# Altium schematic sheet MX8M-Nano-Misc.SchDoc
size B; SheetNumber: 4; SheetTotal: 15
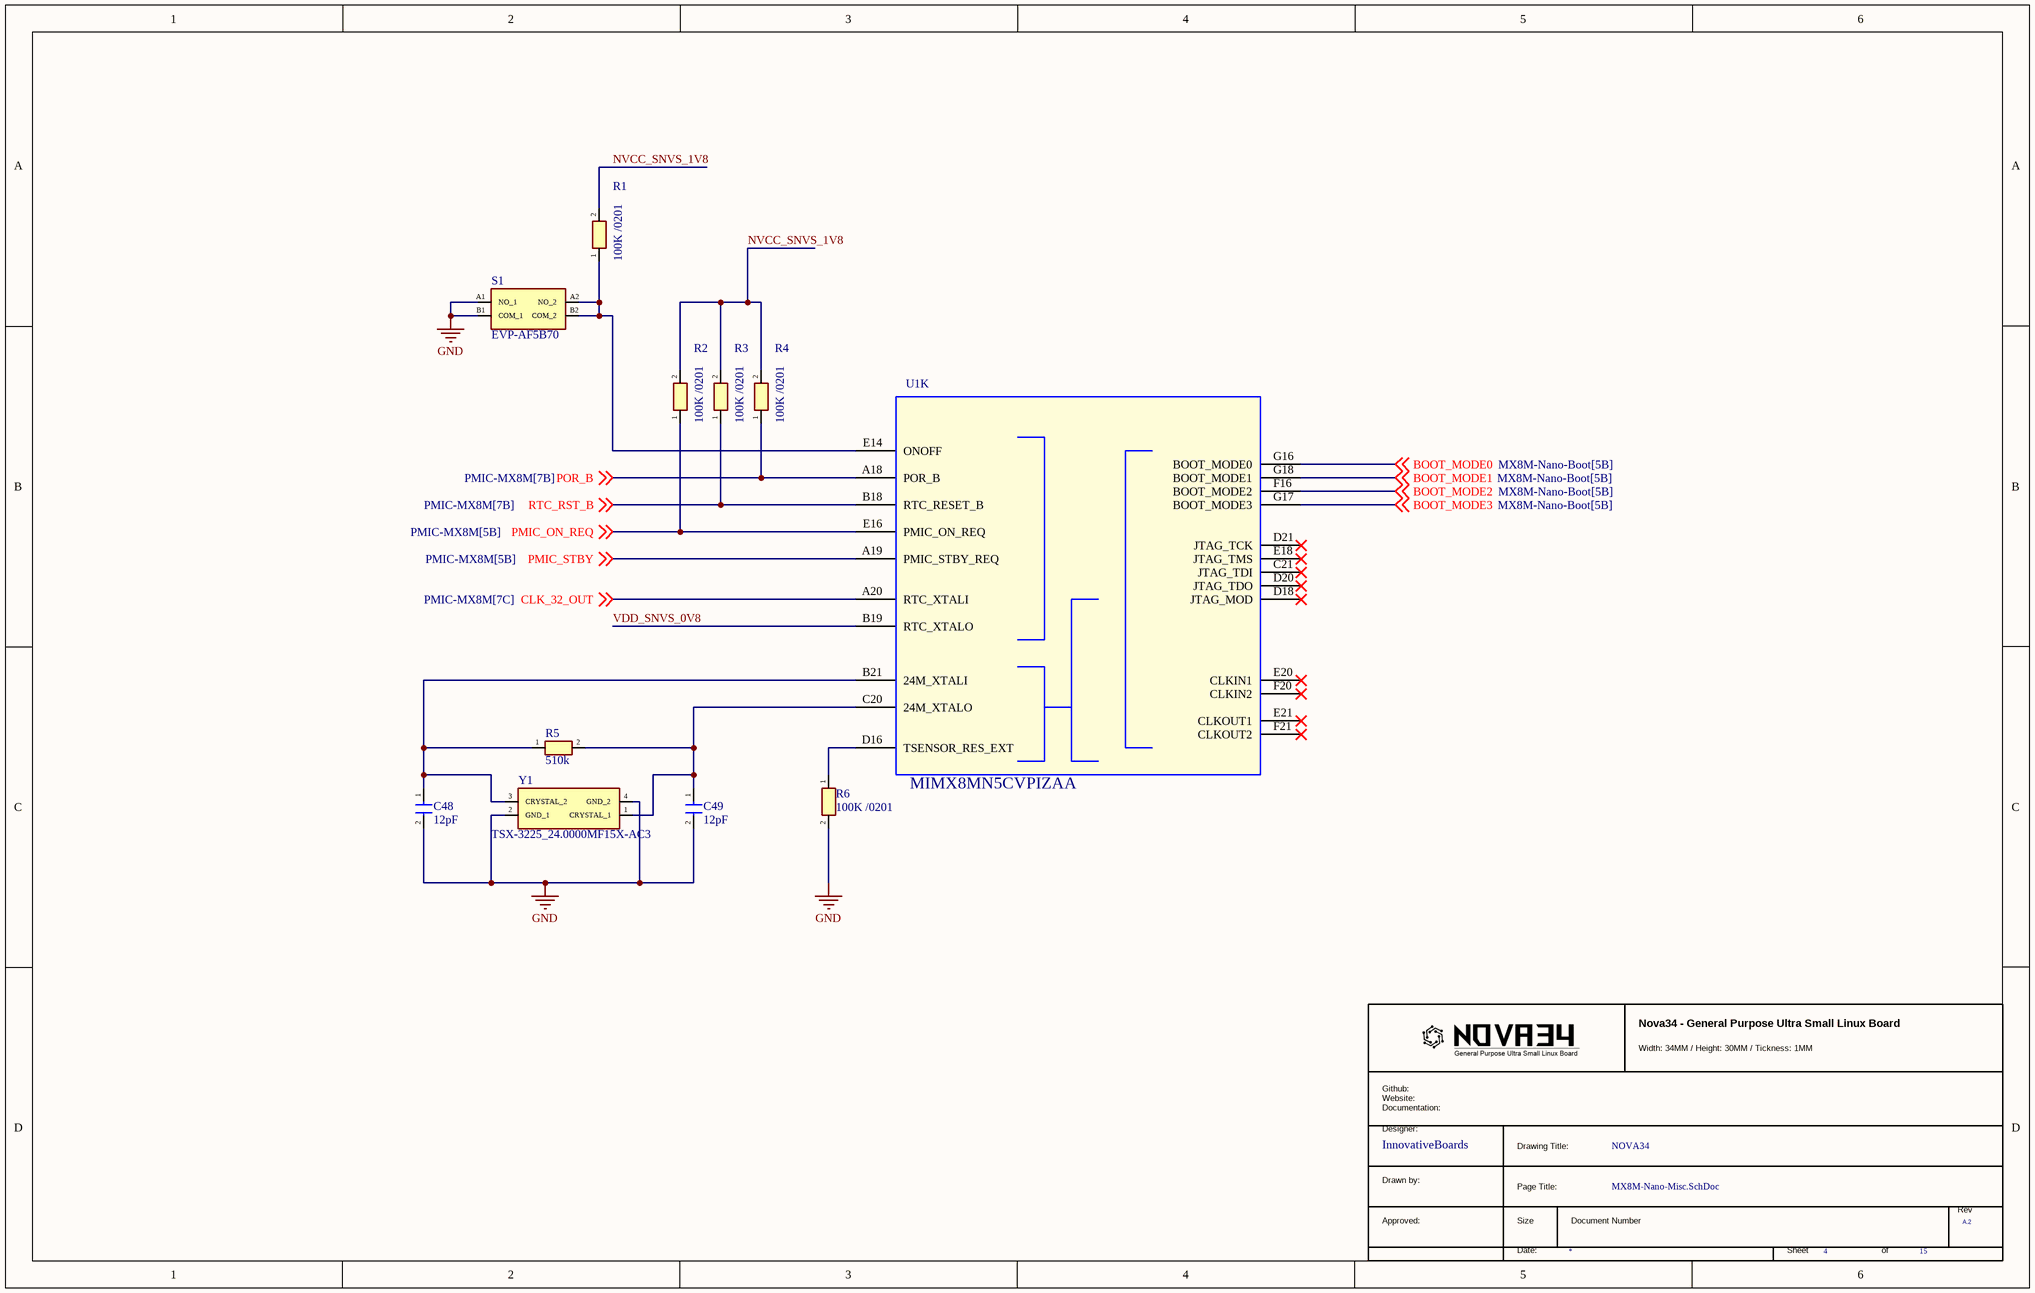
[diagram p0: MX8M-Nano-Misc.SchDoc]

## Parts
*  RevCode: A.2  (hidden comment: TitleBlock_MCPG)  (graphical)
C48  12pF  [CAPC0603X33N]
C49  12pF  [CAPC0603X33N]
R1  100K /0201  [ERJ1GJJ2R4C]
R2  100K /0201  [ERJ1GJJ2R4C]
R3  100K /0201  [ERJ1GJJ2R4C]
R4  100K /0201  [ERJ1GJJ2R4C]
R5  510k  [ERJ2RKD1004X]
R6  100K /0201  [ERJ1GJJ2R4C]
S1  EVP-AF5B70  [EVPAF5B70]
U1  MIMX8MN5CVPIZAA  [BGA306C50P21X21_1100X1100X101]  (part K of 12)
Y1  TSX-3225_24.0000MF15X-AC3  [TSX3225240000MF15XAC3]

## Nets
GND: C48.2 C49.2 R6.2 S1.A1(NO_1) S1.B1(COM_1) Y1.2(GND_1) Y1.4(GND_2)
BOOT_MODE0: U1.G16(BOOT_MODE0) ; off-sheet BOOT_MODE0
BOOT_MODE1: U1.G18(BOOT_MODE1) ; off-sheet BOOT_MODE1
BOOT_MODE2: U1.F16(BOOT_MODE2) ; off-sheet BOOT_MODE2
BOOT_MODE3: U1.G17(BOOT_MODE3) ; off-sheet BOOT_MODE3
CLK_32_OUT: U1.A20(RTC_XTALI) ; off-sheet CLK_32_OUT
NVCC_SNVS_1V8: R1.2 R2.2 R3.2 R4.2
PMIC_ON_REQ: R2.1 U1.E16(PMIC_ON_REQ) ; off-sheet PMIC_ON_REQ
PMIC_STBY: U1.A19(PMIC_STBY_REQ) ; off-sheet PMIC_STBY
POR_B: R4.1 U1.A18(POR_B) ; off-sheet POR_B
RTC_RST_B: R3.1 U1.B18(RTC_RESET_B) ; off-sheet RTC_RST_B
VDD_SNVS_0V8: U1.B19(RTC_XTALO)
NetC48_1: C48.1 R5.1 U1.B21(24M_XTALI) Y1.3(CRYSTAL_2)
NetC49_1: C49.1 R5.2 U1.C20(24M_XTALO) Y1.1(CRYSTAL_1)
NetR1_1: R1.1 S1.A2(NO_2) S1.B2(COM_2) U1.E14(ONOFF)
NetR6_1: R6.1 U1.D16(TSENSOR_RES_EXT)

Not connected (* = marked no-connect by the designer): U1 C21(JTAG_TDI)* D18(JTAG_MOD)* D20(JTAG_TDO)* D21(JTAG_TCK)* E18(JTAG_TMS)* E20(CLKIN1)* E21(CLKOUT1)* F20(CLKIN2)* F21(CLKOUT2)*

## Notes on the sheet
- (in symbol TitleBlock_MCPG) Nova34 - General Purpose Ultra Small Linux Board; Width: 34MM / Height: 30MM / Tickness: 1MM; Github: / Website: / Documentation:; Designer:; InnovativeBoards; Drawing Title:; NOVA34; Drawn by:; Page Title:; Rev; Approved:; Size; Document Number; Date:; Sheet; of

## Library data of the parts
C48 C49 = CGA1A2C0G1E120J030BA: Capacitor; Manufacturer_Name: TDK; Datasheet Link: https://product.tdk.com/system/files/dam/doc/product/capacitor/ceramic/mlcc/catalog/mlcc_automotive_general_en.pdf; Height: 0.33mm; Manufacturer_Part_Number: CGA1A2C0G1E120J030BA; Mouser Part Number: 810-CGA1A2C0G1E120J; Mouser Price/Stock: https://www.mouser.co.uk/ProductDetail/TDK/CGA1A2C0G1E120J030BA?qs=LcTL%2F5vFEzG7k0pRIRPkpw%3D%3D; Arrow Part Number: CGA1A2C0G1E120J030BA; Arrow Price/Stock: https://www.arrow.com/en/products/cga1a2c0g1e120j030ba/tdk?region=europe
R1-R4 R6 = ERJ-1GJF1003C: Resistor; Manufacturer_Name: Panasonic; Datasheet Link: https://industrial.panasonic.com/cdbs/www-data/pdf/RDA0000/AOA0000C304.pdf; Height: 0.26mm; Manufacturer_Part_Number: ERJ-1GJF1003C; Mouser Part Number: 667-ERJ-1GJF1003C; Mouser Price/Stock: https://www.mouser.co.uk/ProductDetail/Panasonic/ERJ-1GJF1003C?qs=OcgtsXO%252B3gvI73%2FyUuQiTQ%3D%3D
R5 = ERJ-2GEJ514X: Resistor; Manufacturer_Name: Panasonic; Datasheet Link: https://datasheet.datasheetarchive.com/originals/distributors/DKDS40/DSANUWW0010687.pdf; Height: 0.4mm; Manufacturer_Part_Number: ERJ-2GEJ514X; Mouser Part Number: 667-ERJ-2GEJ514X; Mouser Price/Stock: https://www.mouser.co.uk/ProductDetail/Panasonic/ERJ-2GEJ514X?qs=YMBIwoNQYdXnnj7PZ2dfzA%3D%3D; Arrow Part Number: ERJ-2GEJ514X; Arrow Price/Stock: https://www.arrow.com/en/products/erj-2gej514x/panasonic?region=europe
S1 = EVP-AF5B70: Switch; Manufacturer_Name: Panasonic; Datasheet Link: https://www.digikey.ph/en/products/detail/panasonic-electronic-components/EVP-AF5B70/3305741?msockid=39f1ec84d77b6f4428b7f904d6676eed; Height: 0.8mm; Manufacturer_Part_Number: EVP-AF5B70; Mouser Part Number: 667-EVP-AF5B70; Mouser Price/Stock: https://www.mouser.co.uk/ProductDetail/Panasonic/EVP-AF5B70?qs=MNPzkKEzRtQbwLa8o3U%252BRQ%3D%3D; Arrow Part Number: EVP-AF5B70; Arrow Price/Stock: https://www.arrow.com/en/products/evpaf5b70/panasonic
U1 = MIMX8MN: IC CPU QUAD CORTEX A53+M7 1.4GHZ -- BGA306; PCB Footprint: pbga306_0p5_sq11mm; AGILE_PN: TMP-CIP-5098; CAD_APPROVED: Yes; PRE_APN: 330-77152; Temp Range: -40¡ãC to 105¡ãC; MFG_NAME01: NXP SEMICONDUCTORS; CLASS: IC; HEIGHT: 1.01MM; ROHS: Yes; MFG_PN01: MIMX8MN5CVPIZAA
Y1 = TSX-3225_24.0000MF15X-AC3: Crystal or Oscillator; Manufacturer_Name: Epson Timing; Manufacturer_Part_Number: TSX-3225 24.0000MF15X-AC3; Datasheet Link: http://www.mouser.com/ds/2/137/1721499-465440.pdf; Height: 0.6mm; Mouser Part Number: 732-TX325-24F15X-AC3; Mouser Price/Stock: https://www.mouser.co.uk/ProductDetail/Epson-Timing/TSX-3225-24.0000MF15X-AC3?qs=tC2qD9afNgpYJ9VgPl1%2FUg%3D%3D; Arrow Part Number: TSX-3225 24.0000MF15X-AC3; Arrow Price/Stock: https://www.arrow.com/en/products/tsx-322524.0000mf15x-ac3/epson-electronics-america?utm_currency=USD&region=nac
* = TitleBlock_MCPG: Page Create Date: March  8, 1995